# EAGLE design VenturinoDrive (EAGLE 7.2.0)
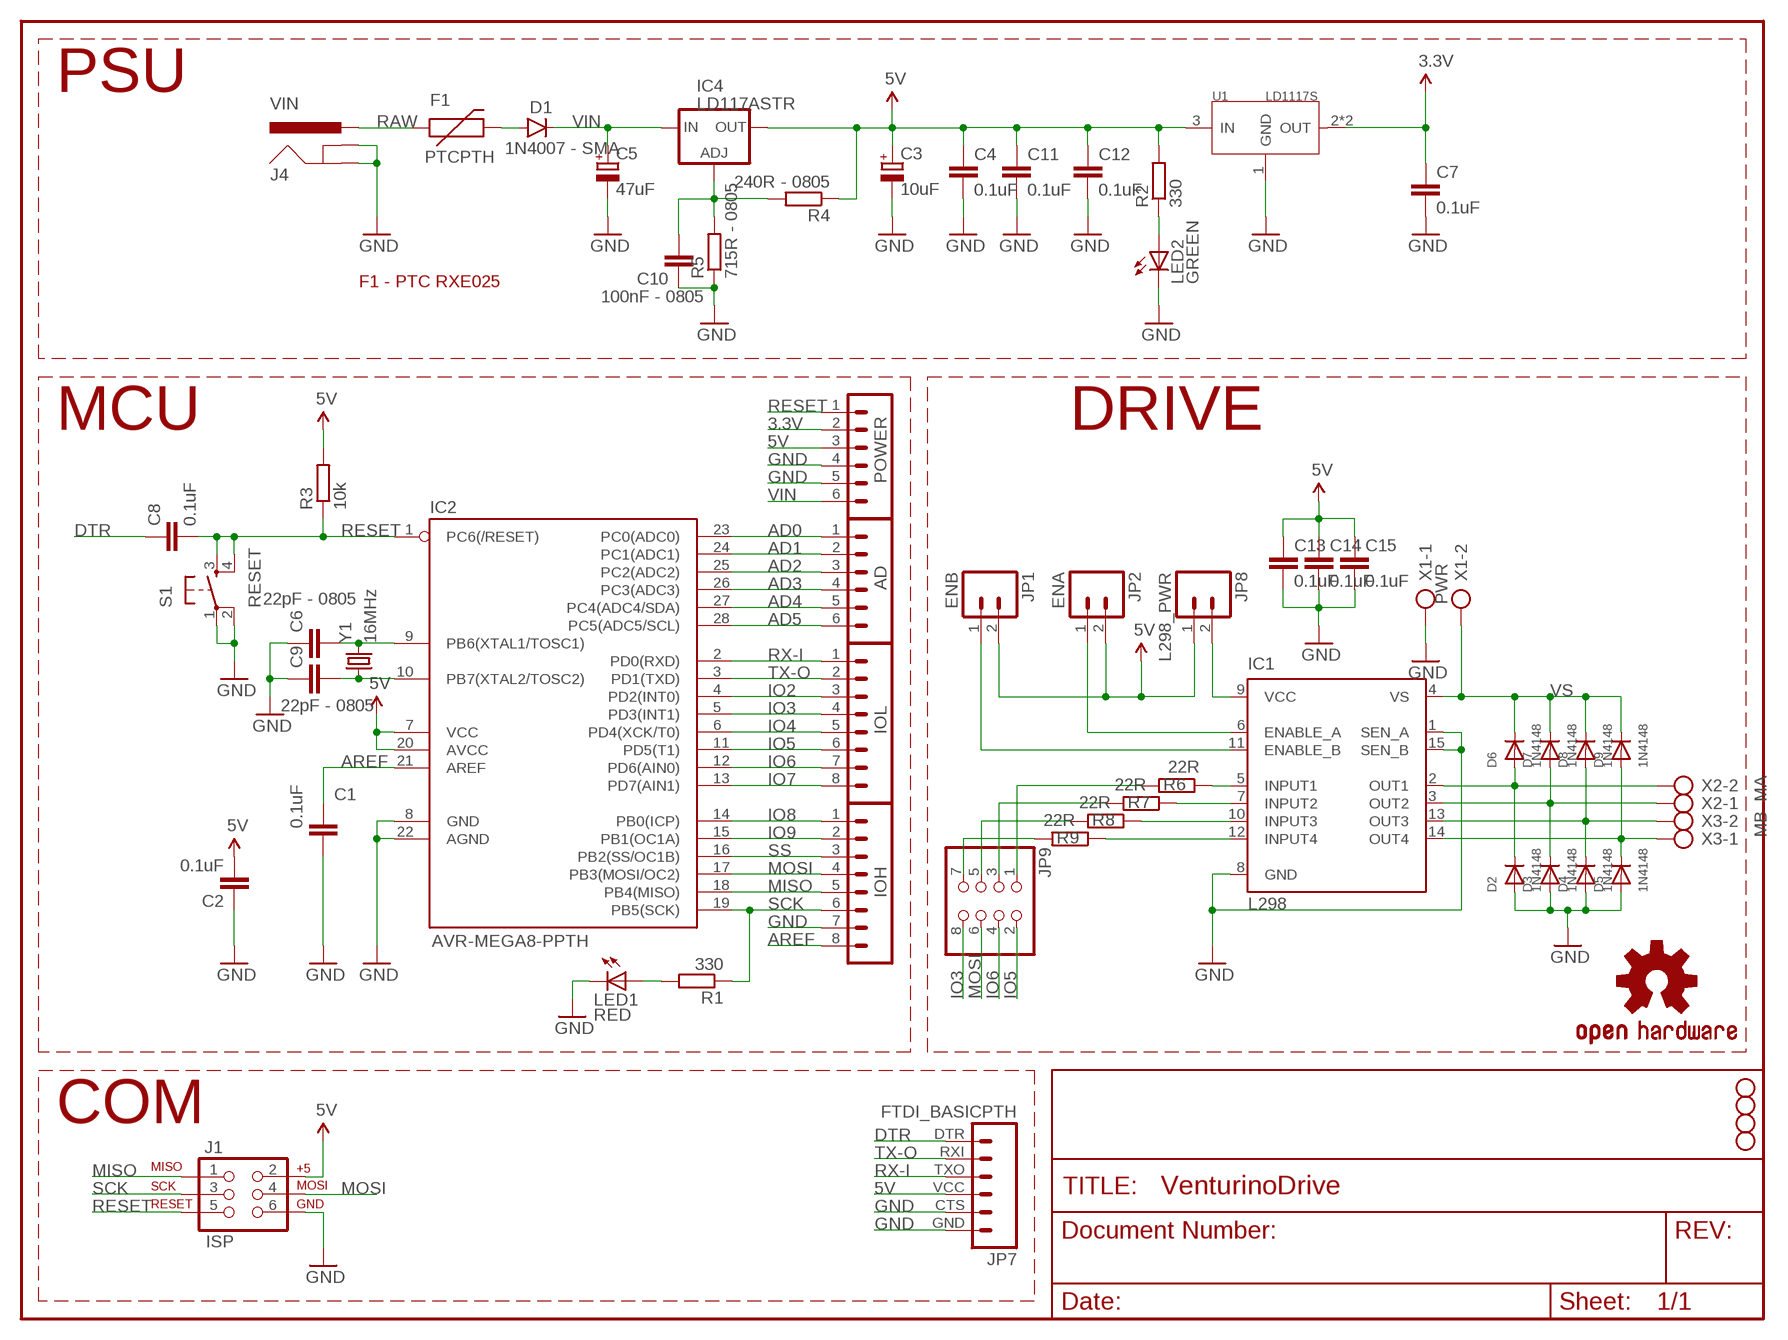
[diagram p0: schematic, sheet 1]

## Parts
AD  M06SIP  [1X06]
C1  0.1uF  C-EUC0805  [C0805]
C2  0.1uF  C-EUC0805  [C0805]
C3  10uF  CPOL-EUB  [PANASONIC_B]
C4  0.1uF  C-EUC0805  [C0805]
C5  47uF  CPOL-EUB  [PANASONIC_B]
C6  22pF - 0805  C-EUC0805  [C0805]
C7  0.1uF  C-EUC0805  [C0805]
C8  0.1uF  C-EUC0805  [C0805]
C9  22pF - 0805  C-EUC0805  [C0805]
C10  100nF - 0805  C-EUC0805  [C0805]
C11  0.1uF  C-EUC0805  [C0805]
C12  0.1uF  C-EUC0805  [C0805]
C13  0.1uF  C-EUC0805  [C0805]
C14  0.1uF  C-EUC0805  [C0805]
C15  0.1uF  C-EUC0805  [C0805]
D1  1N4007 - SMA  DIODESMA  [SMA-DIODE]
D2  1N4148  DIODESMA  [SMADIODE]
D3  1N4148  DIODESMA  [SMADIODE]
D4  1N4148  DIODESMA  [SMADIODE]
D5  1N4148  DIODESMA  [SMADIODE]
D6  1N4148  DIODESMA  [SMADIODE]
D7  1N4148  DIODESMA  [SMADIODE]
D8  1N4148  DIODESMA  [SMADIODE]
D9  1N4148  DIODESMA  [SMADIODE]
F1  PTCPTH  [PTC]
IC1  L298  [MULTIWATT-15]
IC2  AVR-MEGA8-PPTH  [DIL28-3]
IC4  LD117ASTR  [SOT223]
IOH  M081X08  [1X08]
IOL  M081X08  [1X08]
J1  ISP  AVR_SPI_PRG_6PTH  [2X3]
J4  VIN  POWER_JACKPTH_LOCK  [POWER_JACK_PTH_LOCK]
JP1  ENB  M02PTH  [1X02]
JP2  ENA  M02PTH  [1X02]
JP3  STAND-OFF  [STAND-OFF]
JP4  STAND-OFF  [STAND-OFF]
JP5  STAND-OFF  [STAND-OFF]
JP6  STAND-OFF  [STAND-OFF]
JP7  FTDI_BASICPTH  [FTDI_BASIC]
JP8  L298_PWR  M02PTH  [1X02]
JP9  PINHD-2X4  [2X04]
LED1  RED  LEDSML0805  [SML0805]
LED2  GREEN  LEDSML0805  [SML0805]
POWER  M06SIP  [1X06]
R1  330  R-EU_R0805  [R0805]
R2  330  R-EU_R0805  [R0805]
R3  10k  R-EU_R0805  [R0805]
R4  240R - 0805  R-EU_R0805  [R0805]
R5  715R - 0805  R-EU_R0805  [R0805]
R6  22R  R-EU_R0805  [R0805]
R7  22R  R-EU_R0805  [R0805]
R8  22R  R-EU_R0805  [R0805]
R9  22R  R-EU_R0805  [R0805]
S1  RESET  TAC_SWITCHPTH  [TACTILE-PTH]
U1  LD1117S  [SOT-223]
U$7  OSHW-LOGOM  [OSHW-LOGO-M]
X1  PWR  AK500/2  [AK500/2]
X2  MA  AK500/2  [AK500/2]
X3  MB  AK500/2  [AK500/2]
Y1  16MHz  CRYSTALHC49US  [HC49US]

## Nets
3.3V: C7.1 POWER.2 U1.2(OUT) U1.TER(OUT)
5V: C2.2 C3.+ C4.1 C11.1 C12.1 C13.1 C14.1 C15.1 IC2.7(VCC) IC2.20(AVCC) IC4.4(OUT) J1.2 JP1.2 JP2.2 JP7.VCC JP8.1 POWER.3 R2.2 R3.2 R4.1 U1.3(IN)
AD0: AD.1 IC2.23(PC0(ADC0))
AD1: AD.2 IC2.24(PC1(ADC1))
AD2: AD.3 IC2.25(PC2(ADC2))
AD3: AD.4 IC2.26(PC3(ADC3))
AD4: AD.5 IC2.27(PC4(ADC4/SDA))
AD5: AD.6 IC2.28(PC5(ADC5/SCL))
AREF: C1.1 IC2.21(AREF) IOH.8
DTR: C8.1 JP7.DTR
GND: C1.2 C2.1 C3.- C4.2 C5.- C6.1 C7.2 C9.1 C10.1 C11.2 C12.2 C13.2 C14.2 C15.2 D2.A D3.A D4.A D5.A IC1.1(SEN_A) IC1.8(GND) IC1.15(SEN_B) IC2.8(GND) IC2.22(AGND) IOH.7 J1.6 J4.GND J4.GNDBREAK JP7.CTS JP7.GND LED1.C LED2.C POWER.4 POWER.5 R5.1 S1.1 S1.2 U1.1(GND) X1.1
IO2: IC2.4(PD2(INT0)) IOL.3
IO3: IC2.5(PD3(INT1)) IOL.4 JP9.8
IO4: IC2.6(PD4(XCK/T0)) IOL.5
IO5: IC2.11(PD5(T1)) IOL.6 JP9.2
IO6: IC2.12(PD6(AIN0)) IOL.7 JP9.4
IO7: IC2.13(PD7(AIN1)) IOL.8
IO8: IC2.14(PB0(ICP)) IOH.1
IO9: IC2.15(PB1(OC1A)) IOH.2
MISO: IC2.18(PB4(MISO)) IOH.5 J1.1
MOSI: IC2.17(PB3(MOSI/OC2)) IOH.4 J1.4 JP9.6
N$1: LED1.A R1.2
N$2: LED2.A R2.1
N$3: C6.2 IC2.9(PB6(XTAL1/TOSC1)) Y1.2
N$4: C9.2 IC2.10(PB7(XTAL2/TOSC2)) Y1.1
N$5: JP9.7 R9.2
N$6: D1.A F1.P$2
N$7: JP9.5 R8.2
N$8: C10.2 IC4.1(ADJ) R4.2 R5.2
N$9: JP9.3 R7.2
N$10: IC1.6(ENABLE_A) JP2.1
N$11: IC1.11(ENABLE_B) JP1.1
N$12: IC1.9(VCC) JP8.2
N$14: JP9.1 R6.2
N$20: D2.C D6.A IC1.2(OUT1) X2.2
N$21: D3.C D7.A IC1.3(OUT2) X2.1
N$22: D4.C D8.A IC1.13(OUT3) X3.2
N$23: D5.C D9.A IC1.14(OUT4) X3.1
N$24: IC1.5(INPUT1) R6.1
N$25: IC1.7(INPUT2) R7.1
N$26: IC1.10(INPUT3) R8.1
N$27: IC1.12(INPUT4) R9.1
RAW: F1.P$1 J4.PWR
RESET: C8.2 IC2.1(PC6(/RESET)) J1.5 POWER.1 R3.1 S1.3 S1.4
RX-I: IC2.2(PD0(RXD)) IOL.1 JP7.TXO
SCK: IC2.19(PB5(SCK)) IOH.6 J1.3 R1.1
SS: IC2.16(PB2(SS/OC1B)) IOH.3
TX-O: IC2.3(PD1(TXD)) IOL.2 JP7.RXI
VIN: C5.+ D1.C IC4.3(IN) POWER.6
VS: D6.C D7.C D8.C D9.C IC1.4(VS) X1.2

## Notes on the sheet
- PSU
- F1 - PTC RXE025
- MCU | DRIVE
- COM

## Library data of the parts
AD POWER = SparkFun:M06: Header 6 Standard 6-pin 0.1" header. Use with straight break away headers (SKU : PRT-00116), right angle break away headers (PRT-00553), swiss pins (PRT-00743), machine pins (PRT-00117), and female headers (PRT-00115). Molex polarized connector foot print use with SKU : PRT-08094 with associated crimp pins and housings. NOTES ON THE VARIANTS LOCK and LOCK_LONGPADS... This footprint was designed to help hold the alignment of a through-hole component (i.e. 6-pin header) while soldering it into place. You may notice that each hole has been shifted either up or down by 0.005 of an inch from it's more standard position (which is a perfectly straight line). This slight alteration caused the pins (the squares in the middle) to touch the edges of the holes. Because they are alternating, it causes a "brace" to hold the component in place. 0.005 has proven to be the perfect amount of "off-center" position when using our standard breakaway headers. Although looks a little odd when you look at the bare footprint, once you have a header in there, the alteration is very hard to notice. Also, if you push a header all the way into place, it is covered up entirely on the bottom side. This idea of altering the position of holes to aid alignment will be further integrated into the Sparkfun Library for other footprints. It can help hold any component with 3 or more connection pins.
C1 C2 C4 C6-C15 = rcl:C-EU: CAPACITOR, European symbol
C3 C5 = rcl:CPOL-EU: POLARIZED CAPACITOR, European symbol
D1 = SparkFun-DiscreteSemi:DIODE: Diode
D2-D9 = adafruit:DIODE: Diode
F1 = SparkFun:PTC: Resettable Fuse PTC Resettable Fuse. Spark Fun Electronics SKU : COM-08357
IC1 = st-microelectronics:L298: DUAL FULL-BRIDGE DRIVER; MPN: L298N; OC_FARNELL: 1589425; OC_NEWARK: 32M1527
IC2 = SparkFun:AVR-MEGA8-P: MICROCONTROLLER 8 Kbytes FLASH 1 kbytes SRAM 512 bytes EEPROM USART 4-channel 10 bit ADC 2-channel 8 bit ADC
IC4 = v-reg:LD117A?*: Low drop fixed and adjustable positive voltage regulators 1 A Source: http://www.st.com/stonline/products/literature/ds/7194/ld1117axx.pdf
IOH IOL = SparkFun:M08: Header 8 Standard 8-pin 0.1" header. Use with straight break away headers (SKU : PRT-00116), right angle break away headers (PRT-00553), swiss pins (PRT-00743), machine pins (PRT-00117), and female headers (PRT-00115).
J1 = SparkFun:AVR_SPI_PRG_6: AVR ISP 6 Pin This is the reduced ISP connector for AVR programming. Common on Arduino. This footprint will take up less PCB space and can be used with a 10-pin to 6-pin adapter such as SKU: BOB-08508
J4 = SparkFun:POWER_JACK: Power Jack This is the standard 5.5mm barrel jack for power. The PTH is the most common, proven, reliable, footprint. All others are experimental. The Slot footprint only works if the mill layer is transmitted to the PCB fab house so be warned. Spark Fun Electronics SKU : PRT-00119. Mating wall wart : TOL-00298 (and others)
JP1 JP2 JP8 = SparkFun-Connectors:M02: Standard 2-pin 0.1" header. Use with - straight break away headers ( PRT-00116) - right angle break away headers (PRT-00553) - swiss pins (PRT-00743) - machine pins (PRT-00117) - female headers (PRT-00115) Molex polarized connector foot print use with: PRT-08233 with associated crimp pins and housings. 2.54_SCREWTERM for use with PRT-10571. 3.5mm Screw Terminal footprints for PRT-08084 5mm Screw Terminal footprints for use with PRT-08432
JP3-JP6 = SparkFun:STAND-OFF: Stand Off This is the mechanical footprint for a #4 phillips button head screw. Use the keepout ring to avoid running the screw head into surrounding components. SKU : PRT-00447
JP7 = SparkFun:FTDI_BASIC: FTDI Basic: 3.3V and 5V
JP9 = pinhead:PINHD-2X4: PIN HEADER
LED1 LED2 = led:LED: LED OSRAM: - CHIPLED LG R971, LG N971, LY N971, LG Q971, LY Q971, LO R971, LY R971 LH N974, LH R974 LS Q976, LO Q976, LY Q976 LO Q996 - Hyper CHIPLED LW Q18S LB Q993, LB Q99A, LB R99A - SideLED LS A670, LO A670, LY A670, LG A670, LP A670 LB A673, LV A673, LT A673, LW A673 LH A674 LY A675 LS A676, LA A676, LO A676, LY A676, LW A676 LS A679, LY A679, LG A679 - Hyper Micro SIDELED® LS Y876, LA Y876, LO Y876, LY Y876 LT Y87S - SmartLED LW L88C, LW L88S LB L89C, LB L89S, LG L890 LS L89K, LO L89K, LY L89K LS L896, LA L896, LO L896, LY L896 - TOPLED LS T670, LO T670, LY T670, LG T670, LP T670 LSG T670, LSP T670, LSY T670, LOP T670, LYG T670 LG T671, LOG T671, LSG T671 LB T673, LV T673, LT T673, LW T673 LH T674 LS T676, LA T676, LO T676, LY T676, LB T676, LH T676, LSB T676, LW T676 LB T67C, LV T67C, LT T67C, LS T67K, LO T67K, LY T67K, LW E67C LS E67B, LA E67B, LO E67B, LY E67B, LB E67C, LV E67C, LT E67C LW T67C LS T679, LY T679, LG T679 LS T770, LO T770, LY T770, LG T770, LP T770 LB T773, LV T773, LT T773, LW T773 LH T774 LS E675, LA E675, LY E675, LS T675 LS T776, LA T776, LO T776, LY T776, LB T776 LHGB T686 LT T68C, LB T68C - Hyper Mini TOPLED® LB M676 - Mini TOPLED Santana® LG M470 LS M47K, LO M47K, LY M47K Source: http://www.osram.convergy.de LUXEON: - LUMILED® LXK2-PW12-R00, LXK2-PW12-S00, LXK2-PW14-U00, LXK2-PW14-V00 LXK2-PM12-R00, LXK2-PM12-S00, LXK2-PM14-U00 LXK2-PE12-Q00, LXK2-PE12-R00, LXK2-PE12-S00, LXK2-PE14-T00, LXK2-PE14-U00 LXK2-PB12-K00, LXK2-PB12-L00, LXK2-PB12-M00, LXK2-PB14-N00, LXK2-PB14-P00, LXK2-PB14-Q00 LXK2-PR12-L00, LXK2-PR12-M00, LXK2-PR14-Q00, LXK2-PR14-R00 LXK2-PD12-Q00, LXK2-PD12-R00, LXK2-PD12-S00 LXK2-PH12-R00, LXK2-PH12-S00 LXK2-PL12-P00, LXK2-PL12-Q00, LXK2-PL12-R00 Source: www.luxeon.com KINGBRIGHT: KA-3528ASYC Source: www.kingbright.com
R1-R9 = rcl:R-EU_: RESISTOR, European symbol
S1 = SparkFun:TAC_SWITCH: Momentary Switch Button commonly used for reset or general input. Spark Fun Electronics SKU : COM-00097
U1 = IC:LD1117: Low Drop Fixed And Adjustable Positive Voltage Regulators http://www.datasheetcatalog.org/datasheet/SGSThomsonMicroelectronics/mXuqtqv.pdf
U$7 = SparkFun:OSHW-LOGO: Open Source Hardware Logo This logo indicates the piece of hardware it is found on incorporates a OSHW license and/or adheres to the definition of open source hardware found here: http://freedomdefined.org/OSHW
X1-X3 = con-ptr500:AK500/2: CONNECTOR; OC_FARNELL: unknown; OC_NEWARK: unknown
Y1 = SparkFun:CRYSTAL: Crystals Various standard crystals. Proven footprints. Spark Fun Electronics SKU : COM-00534

## Net classes
0 default: width 0.152 mm, drill 0.305 mm, clearance 0.152 mm

## Board
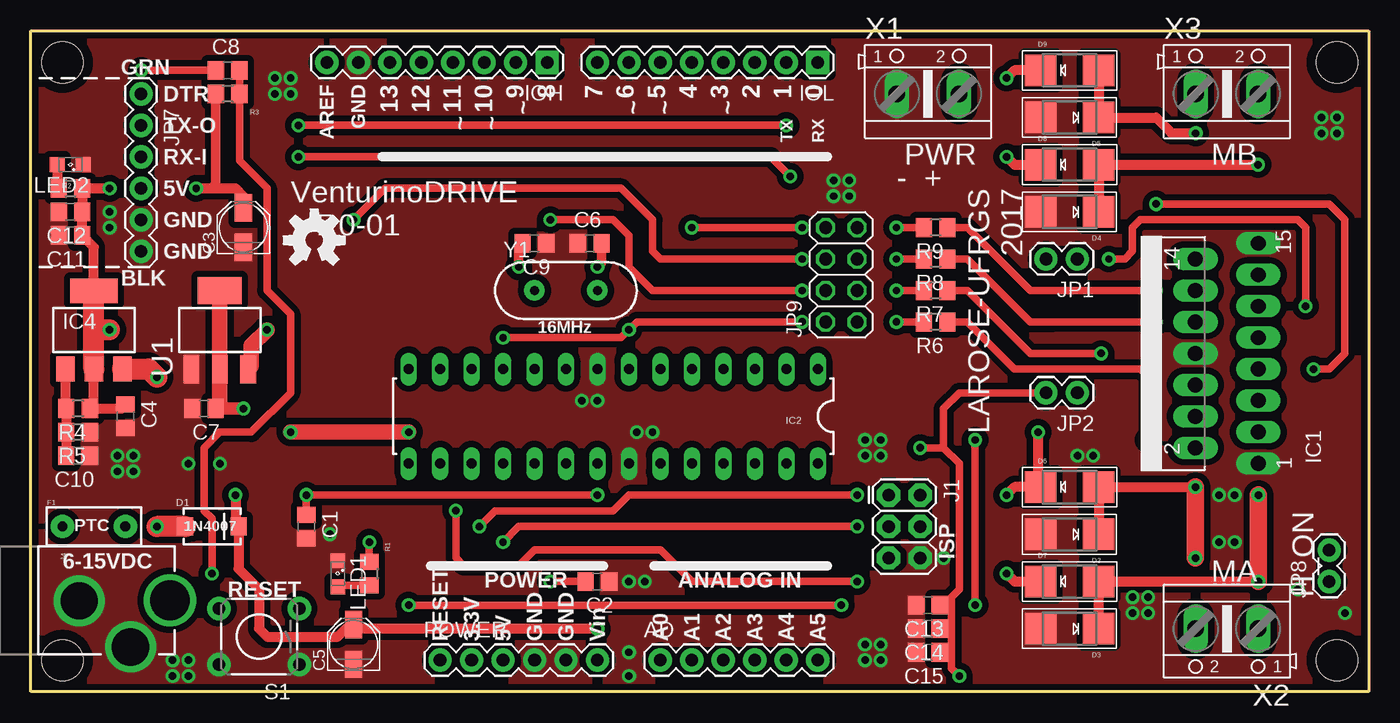
[diagram p1: board, top side]
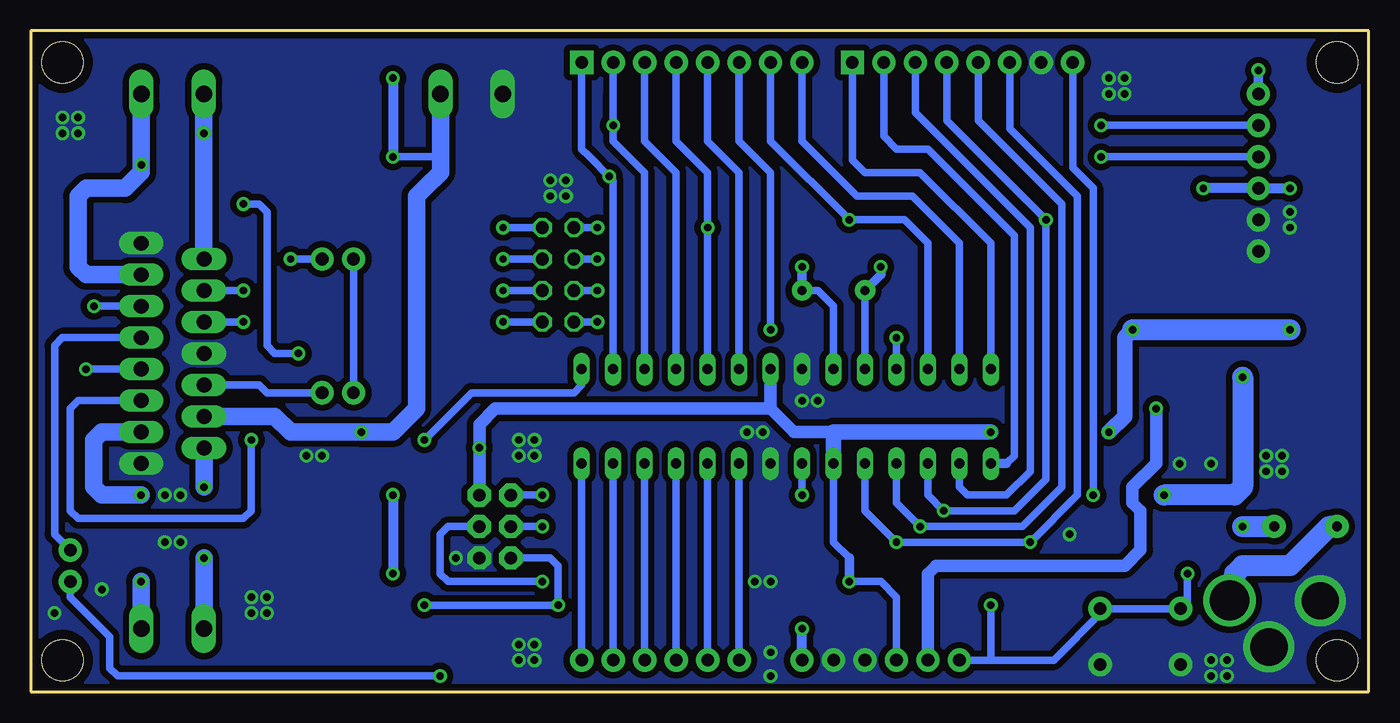
[diagram p2: board, bottom side, seen from below]

Size 107.95 x 53.34 mm. Coordinates in mm from the lower left corner, seen from the top.
Outline: 0,53.34 107.95,53.34 107.95,0 0,0 0,53.34
Copper layers (1*16): Top 0.035mm / dielectric 1.5mm / Bottom 0.035mm
Design rules "SparkFun-2-layer-STANDARD": minimum track width 10mil, minimum drill 20mil, track to track 10mil, track to pad 8mil, pad to pad 8mil, via to via 10mil, smd to smd 8mil, copper to edge 8mil, drill to drill 8mil, minimum pad ring 10mil, minimum via ring 10mil, stop-mask expansion 4mil, vias tented up to drill 25mil, thermal gap 10mil

### Footprints (pad centres in the part's own frame; a part is rotated, then mirrored left to right if it is on the bottom)
1X06 = drill 1.016 pad 1.88: 1 0,0; 2 2.54,0; 3 5.08,0; 4 7.62,0; 5 10.16,0; 6 12.7,0
C0805 = smd 1.3 x 1.5: 1 -0.95,0; 2 0.95,0
PANASONIC_B = smd 2.2 x 1.4: + 1.6,0; - -1.6,0
SMA-DIODE = smd 1.27 x 1.47: A -2.15,0; C 2.15,0
SMADIODE = smd 2.54 x 2.54: A 2.349,0; C -2.349,0
PTC = drill 0.8 pad 1.88: P$1 -2.54,0; P$2 2.54,0
MULTIWATT-15 = drill 1.2 long: 1 -8.89,-7.62; 2 -7.62,-2.54; 3 -6.35,-7.62; 4 -5.08,-2.54; 5 -3.81,-7.62; 6 -2.54,-2.54; 7 -1.27,-7.62; 8 0,-2.54; 9 1.27,-7.62; 10 2.54,-2.54; 11 3.81,-7.62; 12 5.08,-2.54; 13 6.35,-7.62; 14 7.62,-2.54; 15 8.89,-7.62
DIL28-3 = drill 0.813 long: 1 -16.51,-3.81; 2 -13.97,-3.81; 3 -11.43,-3.81; 4 -8.89,-3.81; 5 -6.35,-3.81; 6 -3.81,-3.81; 7 -1.27,-3.81; 8 1.27,-3.81; 9 3.81,-3.81; 10 6.35,-3.81; 11 8.89,-3.81; 12 11.43,-3.81; 13 13.97,-3.81; 14 16.51,-3.81; 15 16.51,3.81; 16 13.97,3.81; 17 11.43,3.81; 18 8.89,3.81; 19 6.35,3.81; 20 3.81,3.81; 21 1.27,3.81; 22 -1.27,3.81; 23 -3.81,3.81; 24 -6.35,3.81; 25 -8.89,3.81; 26 -11.43,3.81; 27 -13.97,3.81; 28 -16.51,3.81
SOT223 = smd 1.5 x 2: 1 -2.3,-3.15; 2 0,-3.15; 3 2.3,-3.15 | smd 3.8 x 2: 4 0,3.15
1X08 = drill 1.016 pad 1.88 square: 1 0,0 | drill 1.016 pad 1.88: 2 2.54,0; 3 5.08,0; 4 7.62,0; 5 10.16,0; 6 12.7,0; 7 15.24,0; 8 17.78,0
2X3 = drill 1.016 pad 1.88 octagon: 1 0,0; 2 0,2.54; 3 2.54,0; 4 2.54,2.54; 5 5.08,0; 6 5.08,2.54
POWER_JACK_PTH_LOCK = drill 2.997 pad 4.115: GND 0.025,6.557; GNDBREAK 3.762,10.7 | drill 3.2 pad 4.115: PWR 0,13.878
1X02 = drill 1.016 pad 1.88: 1 0,0; 2 2.54,0
STAND-OFF = hole 3.302: 0,0
FTDI_BASIC = drill 1.016 pad 1.88: CTS 10.16,0; DTR 0,0; GND 12.7,0; RXI 2.54,0; TXO 5.08,0; VCC 7.62,0
2X04 = drill 1.016 octagon: 1 -3.81,-1.27; 2 -3.81,1.27; 3 -1.27,-1.27; 4 -1.27,1.27; 5 1.27,-1.27; 6 1.27,1.27; 7 3.81,-1.27; 8 3.81,1.27
SML0805 = smd 1.2 x 1.2: A 1.05,0; C -1.05,0
R0805 = smd 1.3 x 1.5: 1 -0.95,0; 2 0.95,0
TACTILE-PTH = drill 1.016 pad 1.88: 1 -3.251,2.261; 2 3.251,2.261; 3 -3.251,-2.261; 4 3.251,-2.261
SOT-223 = smd 1.27 x 2.286: 1 -2.286,-3.175; 2 0,-3.175; 3 2.286,-3.175 | smd 3.556 x 2.159: TER 0,3.175
AK500/2 = drill 1.321 long: 1 -2.515,0; 2 2.515,0
HC49US = drill 0.7 pad 1.651: 1 -2.54,0; 2 2.54,0

### Placement (x,y rotation side)
AD  50.8,2.54 0 top
C1  22.23,13.34 270 top
C2  45.72,8.89 180 top
C3  17.14,37.47 90 top
C4  7.62,22.23 270 top
C5  26.04,3.81 90 top
C6  45.09,36.2 0 top
C7  13.97,22.86 180 top
C8  15.88,50.16 0 top
C9  40.64,36.2 180 top
C10  3.81,19.05 180 top
C11  3.17,36.83 180 top
C12  3.17,38.73 180 top
C13  72.39,6.99 180 top
C14  72.39,5.08 180 top
C15  72.39,3.17 180 top
D1  14.61,13.34 0 top
D2  83.82,12.7 180 top
D3  83.82,5.08 180 top
D4  83.82,38.73 180 top
D5  83.82,46.35 180 top
D6  83.82,16.51 0 top
D7  83.82,8.89 0 top
D8  83.82,42.55 0 top
D9  83.82,50.16 0 top
F1  5.08,13.34 0 top
IC1  91.44,27.3 90 top
IC2  46.99,22.23 180 top
IC4  5.08,29.21 0 top
IOH  41.66,50.8 180 top
IOL  63.5,50.8 180 top
J1  69.22,15.88 270 top
J4  -2.67,7.37 270 top
JP1  84.45,34.92 180 top
JP2  84.45,24.13 180 top
JP3  2.54,50.8 0 top
JP4  105.41,50.8 0 top
JP5  105.41,2.54 0 top
JP6  2.54,2.54 0 top
JP7  8.89,48.26 270 top
JP8  104.78,8.89 90 top
JP9  65.41,33.66 90 top
LED1  24.77,9.53 270 top
LED2  3.17,42.55 180 top
POWER  33.02,2.54 0 top
R1  27.3,9.53 270 top
R2  3.17,40.64 0 top
R3  15.88,48.26 180 top
R4  3.81,22.86 180 top
R5  3.81,20.95 180 top
R6  73.03,29.84 180 top
R7  73.03,32.38 180 top
R8  73.03,34.92 180 top
R9  73.03,37.47 180 top
S1  18.41,4.45 180 top
U1  15.24,29.21 0 top
U$7  22.86,36.45 0 top
X1  72.39,48.26 0 top
X2  96.52,5.08 180 top
X3  96.52,48.26 0 top
Y1  43.18,32.38 0 top

### Tracks (layer width: path | path; a pad name or v marks a point on that pad's centre or on a via)
3.3V  (via drill 0.6 pad 0.51)
  Top 0.813: 15.24,23.18 C7.1
  Top 1.016: v17.14,22.86 C7.1
  Top 1.27: U1.TER U1.2 15.24,23.18
  Bottom 1.016: POWER.2 35.56,9.53 34.92,10.16 19.68,10.16 18.41,11.43 18.41,14.61 19.05,15.24 19.05,16.51 17.14,18.41 v17.14,22.86
5V  (via drill 0.6 pad 0.51)
  Top 0.61: C2.2 v41.91,8.89 | v71.75,19.68 73.66,19.68 | 74.3,6.99 74.3,7.62 74.93,8.26 74.93,18.41 73.66,19.68 | 74.3,6.99 74.3,5.08 | 74.3,5.08 74.3,3.17 | 74.3,3.17 74.3,1.91 v74.93,1.27 | JP2.2 74.93,24.13 73.66,22.86 73.66,19.68 | C14.1 74.3,5.08 | C15.1 74.3,3.17 | C13.1 74.3,6.99
  Top 0.762: R3.2 14.93,40.96 14.61,40.64
  Top 0.813: 5.08,22.86 7.3,22.86 C4.1 | v13.34,40.64 14.61,40.64 16.51,40.64 17.14,40.01 C3.+ | IC4.4 5.08,35.88 C11.1 C12.1 R2.2 v6.35,40.64 | 5.08,22.86 5.08,26.04 | 5.08,22.86 R4.1
  Top 1.27: v19.05,29.21 17.78,27.94 17.78,26.29 U1.3 | v30.48,20.95 v20.95,20.95
  Top 1.676: 5.08,29.21 IC4.4 | v6.35,29.21 5.08,29.21 | 5.08,26.04 5.08,29.21
  Bottom 0.61: v41.91,8.89 39.37,8.89 38.1,7.62 POWER.3 | IC2.20 43.18,12.06 41.91,10.79 | v74.93,1.27 100.97,1.27 101.6,1.91 101.6,4.45 104.78,7.62 JP8.1 | JP1.2 JP2.2
  Bottom 0.762: 41.91,10.79 v41.91,8.89
  Bottom 0.813: v6.35,40.64 JP7.VCC v13.34,40.64
  Bottom 1.016: 48.26,22.86 IC2.7 | 43.18,20.95 46.35,20.95 48.26,22.86 | J1.2 v71.75,19.68 71.75,21.59 70.48,22.86 48.26,22.86
  Bottom 1.27: IC2.20 43.18,20.95 v30.48,20.95 | v20.95,20.95 19.68,22.23 19.68,28.57 v19.05,29.21
  Bottom 1.676: v6.35,29.21 v19.05,29.21
AD0
  Bottom 0.61: IC2.23 AD.1
AD1
  Bottom 0.61: AD.2 IC2.24
AD2
  Bottom 0.61: IC2.25 AD.3
AD3
  Bottom 0.61: AD.4 IC2.26
AD4
  Bottom 0.61: IC2.27 AD.5
AD5
  Bottom 0.61: IC2.28 AD.6
AREF  (via drill 0.6 pad 0.51)
  Top 0.61: v45.72,15.88 v22.23,15.88 C1.1
  Bottom 0.61: IOH.8 23.88,42.29 22.23,40.64 v22.23,15.88 | v45.72,15.88 IC2.21
DTR  (via drill 0.6 pad 0.51)
  Top 0.61: C8.1 v8.89,50.16
  Bottom 0.762: v8.89,50.16 JP7.DTR
GND  (via drill 0.6 pad 0.51)
  other vias: 11.43,2.54 12.7,2.54 11.43,1.27 12.7,1.27 19.68,49.53 20.95,49.53 19.68,48.26 20.95,48.26 6.99,19.05 6.99,17.78 8.26,19.05 8.26,17.78 48.26,3.17 48.26,1.27 48.26,8.89 67.31,20.32 68.58,20.32 67.31,19.05 68.58,19.05 64.77,41.27 66.04,41.27 64.77,40.01 66.04,40.01 88.9,7.62 90.17,7.62 49.53,8.89 67.31,2.54 67.31,3.81 68.58,2.54 68.58,3.81 104.14,46.35 105.41,46.35 104.14,45.09 105.41,45.09 24.13,12.7 44.45,23.5 45.72,23.5 48.9,20.95 73.66,10.79 6.35,38.73 6.35,37.47 84.45,19.05 85.72,19.05 88.9,6.35 90.17,6.35 106.05,6.35 102.23,8.26 95.89,12.06 97.16,12.06 95.89,15.88 97.16,15.88 50.16,20.95 12.7,18.41 15.24,18.41
  pour Bottom (isolate 0.508, no thermals): -4.45,66.04 154.94,67.31 157.48,-10.79 -3.81,-11.43
  pour Top (isolate 0.508, rank 3, no thermals): -4.45,55.88 151.76,57.15 151.13,-7.62 -3.81,-7.62
IO2
  Bottom 0.61: IC2.4 55.88,28.57 55.88,41.91 58.42,44.45 IOL.3
IO3  (via drill 0.6 pad 0.51)
  Top 0.61: v62.23,37.47 v53.34,37.47
  Bottom 0.61: IOL.4 55.88,44.45 53.34,41.91 v53.34,37.47 IC2.5 | JP9.8 v62.23,37.47
IO4
  Bottom 0.61: IC2.6 50.8,28.57 50.8,41.91 53.34,44.45 IOL.5
IO5  (via drill 0.6 pad 0.51)
  Top 0.61: v38.1,28.57 47.62,28.57 v48.26,29.21 48.9,29.84 v62.23,29.84
  Bottom 0.61: v38.1,28.57 IC2.11 | IOL.6 50.8,44.45 48.26,41.91 v48.26,29.21 | JP9.2 v62.23,29.84
IO6  (via drill 0.6 pad 0.51)
  Top 0.61: v62.23,32.38 50.16,32.38 48.26,34.29 48.26,36.83 46.99,38.1 v41.91,38.1
  Bottom 0.61: IC2.12 35.56,36.2 37.47,38.1 v41.91,38.1 48.26,44.45 IOL.7 | JP9.4 v62.23,32.38
IO7
  Bottom 0.61: IC2.13 33.02,36.2 36.83,40.01 41.27,40.01 45.72,44.45 IOL.8
IO8
  Bottom 0.61: IOH.1 41.66,42.93 40.64,41.91 36.2,41.91 30.48,36.2 IC2.14
IO9
  Bottom 0.61: IOH.2 39.12,44.83 38.1,43.81 35.56,43.81 28.57,36.83 28.57,19.05 29.21,18.41
  Bottom 0.762: 29.21,18.41 IC2.15
MISO  (via drill 0.6 pad 0.51)
  Top 0.61: v66.67,15.88 48.26,15.88 46.99,14.61 37.47,14.61 v36.2,13.34
  Bottom 0.61: IOH.5 31.5,46.1 24.77,39.37 24.77,16.51 27.94,13.34 v36.2,13.34 38.1,15.24 IC2.18 | J1.1 v66.67,15.88
MOSI  (via drill 0.6 pad 0.51)
  Top 0.61: v66.67,8.89 53.34,8.89 50.8,11.43 40.64,11.43 39.37,10.16 34.92,10.16 34.29,10.79 v34.29,14.61 | v62.23,34.92 50.8,34.92 50.16,35.56 50.16,38.1 47.62,40.64 28.57,40.64 v26.04,38.1
  Bottom 0.61: IOH.4 34.04,46.1 v26.04,38.1 26.04,17.14 28.57,14.61 v34.29,14.61 35.56,15.88 IC2.17 | J1.4 74.3,13.34 74.93,12.7 74.93,9.53 74.3,8.89 v66.67,8.89 | JP9.6 v62.23,34.92
N$1
  Top 0.61: R1.2 24.86,8.57 LED1.A
N$2
  Top 0.813: LED2.A 2.12,40.74 R2.1
N$3  (via drill 0.6 pad 0.51)
  Top 0.762: C6.2 46.03,34.6 v45.72,34.29
  Bottom 0.61: Y1.2 44.45,32.38 43.18,31.11 IC2.9
  Bottom 0.762: v45.72,34.29 Y1.2
N$4  (via drill 0.6 pad 0.51)
  Top 0.762: v39.37,34.29 39.37,35.88 C9.2
  Bottom 0.61: IC2.10 Y1.1
  Bottom 0.762: v39.37,34.29 39.37,33.66 Y1.1
N$5  (via drill 0.6 pad 0.51)
  Top 0.61: v69.85,37.47 R9.2
  Bottom 0.61: JP9.7 v69.85,37.47
N$6  (via drill 0.6 pad 0.51)
  Top 1.676: D1.A v10.16,13.34
  Bottom 1.676: v10.16,13.34 F1.P$2
N$7  (via drill 0.6 pad 0.51)
  Top 0.61: v69.85,34.92 R8.2
  Bottom 0.61: v69.85,34.92 JP9.5
N$8
  Top 0.813: IC4.1 2.78,22.94 | C10.2 R5.2 R4.2
  Top 1.016: 2.78,22.94 R4.2
N$9  (via drill 0.6 pad 0.51)
  Top 0.61: R7.2 v69.85,32.38
  Bottom 0.61: v69.85,32.38 JP9.3
N$10
  Bottom 0.61: IC1.6 89.53,24.77 88.9,24.13 JP2.1
N$11  (via drill 0.6 pad 0.51)
  Top 0.61: v102.87,31.11 102.87,37.47 102.23,38.1 89.53,38.1 88.9,37.47 88.9,35.56 88.27,34.92 v87,34.92
  Bottom 0.61: JP1.1 v87,34.92 | v102.87,31.11 IC1.11
N$12
  Bottom 0.61: IC1.9 105.41,28.57 106.05,27.94 106.05,12.7 JP8.2
N$14  (via drill 0.6 pad 0.51)
  Top 0.61: R6.2 v69.85,29.84
  Bottom 0.61: JP9.1 v69.85,29.84
N$20  (via drill 0.6 pad 0.51)
  Top 0.813: v93.98,16.51 D6.A D2.C
  Top 1.422: v93.98,16.51 v93.98,10.79
  Bottom 1.422: IC1.2 v93.98,16.51 | v93.98,10.79 93.98,5.11 X2.2
N$21  (via drill 0.6 pad 0.51)
  Top 0.813: v99.06,8.89 D7.A D3.C
  Top 1.422: v99.06,15.88 v99.06,8.89
  Bottom 1.422: IC1.3 102.23,20.95 102.87,20.32 102.87,16.51 102.23,15.88 v99.06,15.88 | v99.06,8.89 99.06,5.11 X2.1
N$22  (via drill 0.6 pad 0.51)
  Top 0.813: v99.03,42.55 D8.A D4.C
  Bottom 1.422: X3.2 v99.03,42.55 99.03,41.94 100.33,40.64 103.5,40.64 104.14,40.01 104.14,34.29 103.5,33.66 IC1.13
N$23  (via drill 0.6 pad 0.51)
  Top 0.813: v94,45.09 92.08,45.09 90.81,46.35 D5.C D9.A
  Bottom 1.422: X3.1 v94,45.09 94,34.95 IC1.14
N$24  (via drill 0.6 pad 0.51)
  Top 0.61: R6.1 75.56,29.84 79.38,26.04 89.53,26.04 90.17,25.4 v90.17,20.32
  Bottom 0.61: IC1.5 104.14,23.5 104.78,22.86 104.78,14.61 104.14,13.97 90.81,13.97 90.17,14.61 v90.17,20.32
N$25  (via drill 0.6 pad 0.51)
  Top 0.61: v90.81,39.37 104.78,39.37 106.05,38.1 106.05,27.3 104.78,26.04 v103.5,26.04 | v86.36,27.3 80.64,27.3 75.56,32.38 R7.1
  Bottom 0.61: v103.5,26.04 IC1.7 | v86.36,27.3 88.27,27.3 88.9,27.94 88.9,38.73 89.53,39.37 v90.81,39.37
N$26  (via drill 0.6 pad 0.51)
  Top 0.61: v90.81,29.84 82.55,29.84 80.64,29.84 75.56,34.92 R8.1
  Bottom 0.61: v90.81,29.84 IC1.10
N$27  (via drill 0.6 pad 0.51)
  Top 0.61: v90.81,32.38 83.19,32.38 80.64,32.38 75.56,37.47 R9.1
  Bottom 0.61: IC1.12 v90.81,32.38
RAW
  Bottom 1.676: F1.P$1 3.17,13.34 6.35,10.16 10.16,10.16 10.79,9.53 10.79,7.78 J4.PWR
RESET  (via drill 0.6 pad 0.51)
  Top 0.61: C8.2 R3.1 16.82,42.87 19.05,40.64 19.05,32.38 20.95,30.48 20.95,24.13 17.78,20.95 15.24,20.95 13.97,19.68 13.97,14.61 14.61,13.97 v14.61,9.53 | v65.41,6.99 v30.48,6.99 | v76.2,20.32 v76.2,6.99
  Bottom 0.61: POWER.1 30.48,2.54 | 30.48,2.54 25.4,2.54 21.59,6.35 21.59,6.63 | S1.3 S1.4 14.61,7.26 v14.61,9.53 | v30.48,6.99 30.48,2.54 | J1.5 66.04,10.79 65.41,10.16 v65.41,6.99 v76.2,6.99 | v76.2,20.32 72.39,24.13 64.14,24.13 63.5,24.77 IC2.1
  Bottom 1.016: 21.59,6.63 S1.3
RX-I  (via drill 0.6 pad 0.51)
  Top 0.61: v21.59,43.18 59.69,43.18 v61.28,41.59
  Bottom 0.61: IOL.1 63.5,43.81 62.87,43.18 v61.28,41.59 60.96,41.27 IC2.2 | JP7.TXO v21.59,43.18
SCK  (via drill 0.6 pad 0.51)
  Top 0.61: R1.1 v27.3,12.06 | v66.67,13.34 39.37,13.34 v38.1,12.06
  Bottom 0.61: IOH.6 28.96,45.47 23.5,40.01 23.5,15.88 v27.3,12.06 36.83,12.06 v38.1,12.06 40.64,14.61 IC2.19 | J1.3 v66.67,13.34
SS
  Bottom 0.61: IOH.3 36.58,46.74 27.3,37.47 27.3,17.78 29.21,15.88 32.38,15.88 33.02,16.51 IC2.16
TX-O  (via drill 0.6 pad 0.51)
  Top 0.61: v21.59,45.72 v60.96,45.72
  Bottom 0.61: IOL.2 60.96,48.26 v60.96,45.72 60.96,44.45 58.42,41.91 IC2.3 | JP7.RXI v21.59,45.72
VIN  (via drill 0.6 pad 0.51)
  Top 0.61: 25.4,5.08 25.7,5.08 C5.+
  Top 0.762: 16.51,13.58 D1.C
  Top 0.813: v16.51,15.88 16.51,13.58 | D1.C 16.75,9.91 18.41,8.26 18.41,5.08 19.05,4.45 24.77,4.45 25.4,5.08 | v45.72,5.08 26.36,5.08 C5.+
  Top 1.676: IC4.3 9.5,26.06 v10.16,25.4
  Bottom 0.813: POWER.6 v45.72,5.08
  Bottom 1.676: v10.16,25.4 10.16,16.51 10.79,15.88 v16.51,15.88
VS  (via drill 0.6 pad 0.51)
  Top 0.813: v78.74,15.88 79.38,16.51 D6.C 81.28,16.7 v81.28,20.95 | v78.74,9.53 79.38,8.89 D7.C | D9.C 79.38,50.16 v78.74,49.53 | v78.74,43.18 79.38,42.55 D8.C
  Bottom 0.61: v78.74,43.18 74.91,43.18
  Bottom 0.813: v78.74,15.88 v78.74,9.53 | v78.74,49.53 v78.74,43.18
  Bottom 1.422: X1.2 74.91,43.18 74.91,41.91 76.17,40.64 76.2,40.64 76.83,40.01 76.83,22.86 78.74,20.95 v81.28,20.95 87,20.95 88.27,22.23 IC1.4

### Text on the board
tPlace: GRN | AREF | GND | 13 | 12 | 11 | 10 | 9 | 8 | 7 | 6 | 5 | 4 | 3 | 2 | 1 | 0 | DTR | ~ | ~ | ~ | ~ | ~ | ~ | TX-O | TX | RX | RX-I | PWR | MB | - + | LAROSE-UFRGS / 2017 | 5V | GND | VenturinoDRIVE / R0-01 | GND | BLK | 16MHz | PTC | ISP | 1N4007 | 6-15VDC | RESET | MA | POWER | ANALOG IN | H_ON | RESET | 3.3V | 5V | GND | GND | Vin | A0 | A1 | A2 | A3 | A4 | A5